# Altium project OBDII.PrjPCB
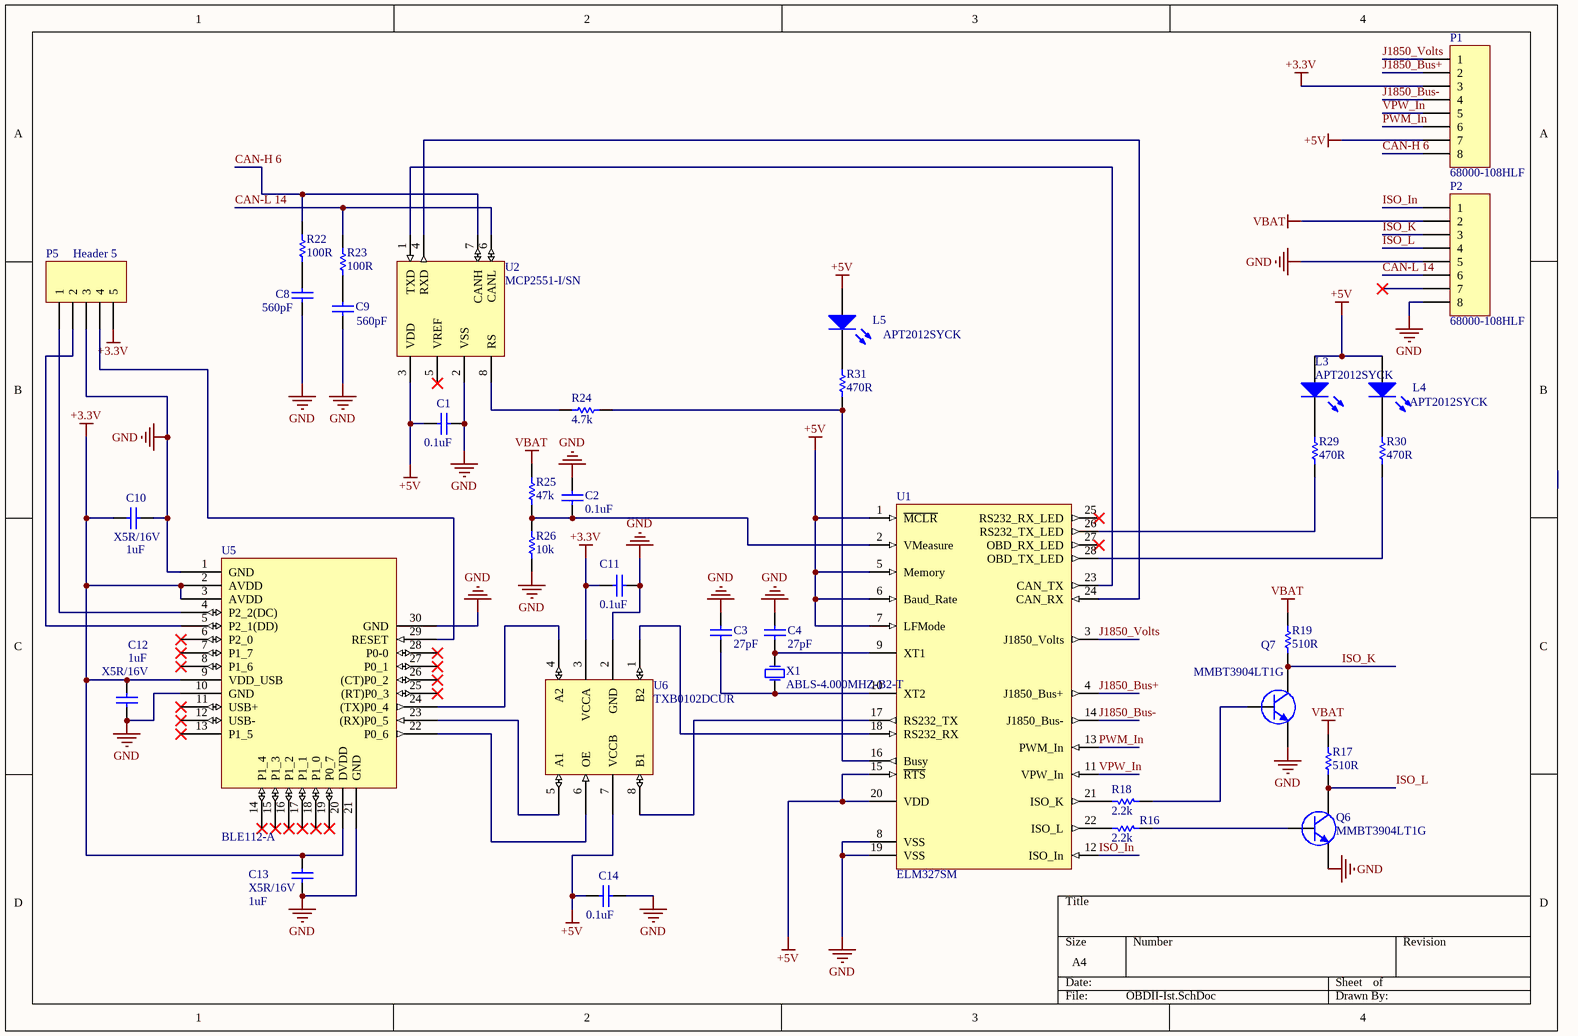
[diagram p0: OBDII-Ist.SchDoc]
2 sheets, 77 parts. Net scope: global (net labels, ports and power ports of the same name join across sheets).
Board file: OBDII-Ist.PcbDoc
Sheets:
  OBDII-Ist.SchDoc
  Power_.SchDoc

## Sheet OBDII-Ist.SchDoc
size A4

### Parts
C1  0.1uF  [1608[0603]]
C2  0.1uF  [1608[0603]]
C3  27pF  [1608[0603]]
C4  27pF  [1608[0603]]
C8  560pF  [0402]
C9  560pF  [0402]
C10  X5R/16V  value 1uF  [0402]
C11  0.1uF  [1608[0603]]
C12  X5R/16V  value 1uF  [0402]
C13  X5R/16V  value 1uF  [0402]
C14  0.1uF  [1608[0603]]
L3  APT2012SYCK  [LED-0805]
L4  APT2012SYCK  [LED-0805]
L5  APT2012SYCK  [LED-0805]
P1  68000-108HLF  [HDR1X8]
P2  68000-108HLF  [HDR1X8]
P5  Header 5  [HDR1X5]
Q6  MMBT3904LT1G  [SOT23]
Q7  MMBT3904LT1G  [SOT23]
R16  2.2k  [ERA-0805]
R17  510R  [ERJ-1210]
R18  2.2k  [ERA-0805]
R19  510R  [ERJ-1210]
R22  100R  [ERA-0805]
R23  100R  [ERA-0805]
R24  4.7k  [ERA-0805]
R25  47k  [ERA-0805]
R26  10k  [ERA-0805]
R29  470R  [ERA-0805]
R30  470R  [ERA-0805]
R31  470R  [ERA-0805]
U1  ELM327SM  [SOIC127P1030X264-28N]
U2  MCP2551-I/SN  [SOIC8N]
U5  BLE112-A  [BLE112-A - II]
U6  TXB0102DCUR  [TXB0102DCUR]
X1  ABLS-4.000MHZ-B2-T  [HC-49/US]

### Nets
+3.3V: C10.1 C11.1 C12.2 C13.2 P1.3 P5.5 U5.2(AVDD) U5.3(AVDD) U5.9(VDD_USB) U5.20(DVDD) U6.3(VCCA)
+5V: C1.1 C14.1 L3.1(A) L4.1(A) L5.1(A) P1.7 U1.1(~{MCLR}) U1.5(Memory) U1.6(Baud_Rate) U1.7(LFMode) U1.15(~{RTS}) U1.20(VDD) U2.3(VDD) U6.7(VCCB)
GND: C1.2 C2.2 C3.2 C4.2 C8.1 C9.1 C10.2 C11.2 C12.1 C13.1 C14.2 P2.5 P2.8 P5.3 Q6.2(E) Q7.2(E) R26.1 U1.8(VSS) U1.19(VSS) U2.2(VSS) U5.1(GND) U5.10(GND) U5.21(GND) U5.30(GND) U6.2(GND)
VBAT: P2.2 R17.2 R19.2 R25.2
CAN-H 6: P1.8 R22.2 U2.7(CANH)
CAN-L 14: P2.6 R23.2 U2.6(CANL)
ISO_In: P2.1 U1.12(ISO_In)
ISO_K: P2.3 Q7.3(C) R19.1
ISO_L: P2.4 Q6.3(C) R17.1
J1850_Bus+: P1.2 U1.4(J1850_Bus+)
J1850_Bus-: P1.4 U1.14(J1850_Bus-)
J1850_Volts: P1.1 U1.3(J1850_Volts)
PWM_In: P1.6 U1.13(PWM_In)
VPW_In: P1.5 U1.11(VPW_In)
NetC2_1: C2.1 R25.1 R26.2 U1.2(VMeasure)
NetC3_1: C3.1 U1.10(XT2) X1.1(OSC1)
NetC4_1: C4.1 U1.9(XT1) X1.2(OSC2)
NetC8_2: C8.2 R22.1
NetC9_2: C9.2 R23.1
NetL3_2: L3.2(K) R29.2
NetL4_2: L4.2(K) R30.2
NetL5_2: L5.2(K) R31.2
NetP5_1: P5.1 U5.4(P2_2(DC))
NetP5_2: P5.2 U5.5(P2_1(DD))
NetP5_4: P5.4 U5.29(RESET)
NetQ6_1: Q6.1(B) R16.1
NetQ7_1: Q7.1(B) R18.1
NetR16_2: R16.2 U1.22(ISO_L)
NetR18_2: R18.2 U1.21(ISO_K)
NetR24_1: R24.1 U2.8(RS)
NetR24_2: R24.2 R31.1 U1.16(Busy)
NetR29_1: R29.1 U1.26(RS232_TX_LED)
NetR30_1: R30.1 U1.28(OBD_TX_LED)
NetU1_17: U1.17(RS232_TX) U6.8(B1)
NetU1_18: U1.18(RS232_RX) U6.1(B2)
NetU1_23: U1.23(CAN_TX) U2.1(TXD)
NetU1_24: U1.24(CAN_RX) U2.4(RXD)
NetU5_22: U5.22(P0_6) U6.6(OE)
NetU5_23: U5.23((RX)P0_5) U6.5(A1)
NetU5_24: U5.24((TX)P0_4) U6.4(A2)

Not connected (* = marked no-connect by the designer): P2 7*; U1 25(RS232_RX_LED)* 27(OBD_RX_LED)*; U2 5(VREF)*; U5 6(P2_0)* 7(P1_7)* 8(P1_6)* 11(USB+)* 12(USB-)* 13(P1_5)* 14(P1_4)* 15(P1_3)* 16(P1_2)* 17(P1_1)* 18(P1_0)* 19(P0_7)* 25((RT)P0_3)* 26((CT)P0_2)* 27(P0_1)* 28(P0-0)*

### Library data of the parts
C1 C2 C11 C14 = CGA3E2X7R1E104K080AA: Surface-Mount Ceramic Multilayer Capacitor, 0.1uF, X7R, 10% Tolerance, 0603 Size, 25V; PackageReference: 0402; PackageDescription: Chip Capacitor; Site: http://product.tdk.com/capacitor/mlcc/en/documents/mlccspec_automotive_general_midvoltage_en.pdf; Value: 0.1uF; Publisher: Altium Limited
C3 C4 = CC0603JRNPO9BN270: Surface-Mount Ceramic Multilayer Capacitor, 27pF, 5% Tolerance, 0603 Size, 50V; PackageReference: 1608(0603); Publisher: Altium Limited; PackageDescription: Chip Capacitor; Site: http://www.mouser.com/ds/2/447/UPY-GP_NP0_16V-to-50V_%288%29-217813.pdf; Value: 27pF
C8 C9 = C0402C561J5GACTU: Surface-Mount Ceramic Multilayer Capacitor, 560pF, 5% Tolerance, 0402 Size, 50V; PackageReference: 0402; Publisher: Altium Limited; PackageDescription: Chip Capacitor; Site: http://www.kemet.com/kemet/web/homepage/kechome.nsf/vapubfiles/KEM_C1003_C0G_SMD.pdf/$file/KEM_C1003_C0G_SMD.pdf; Value: 560pF
C10 C12 C13 = Cap Semi: Capacitor (Semiconductor SIM Model); Published: 8-Jun-2000; LatestRevisionDate: 29-May-2009; LatestRevisionNote: IPC-7351 Footprint Added.; PackageReference: C1206; Publisher: Altium Limited; PackageDescription: Chip Capacitor
L3-L5 = APT2012SYCK: Typical BLUE SiC LED; LatestRevisionNote: PCB Footprint replaced.; PackageReference: 0805; PackageDescription: SM LED; Body 2.0x 1.25 x 0.75mm, inc leads (LxWxH typ)
P1 P2 = 68000-108HLF: Header, 8-Pin, 2.54 pitch, 1 row; LatestRevisionDate: 17-Jul-2002; LatestRevisionNote: Re-released for DXP Platform.; Publisher: Altium Limited
P5 = Header 5: Header, 5-Pin; LatestRevisionDate: 17-Jul-2002; LatestRevisionNote: Re-released for DXP Platform.; Publisher: Altium Limited
Q6 Q7 = MMBT3904L: NPN 3904 General Purpose Amplifier; Manufacturer: ON Semiconductor; Value: 0.2A, 40V; Approved: Yes by Implemenation; TargetLibrary: Transistors; Published: 8/13/2009; Publisher: Vanteon; LeadFree: Yes; RoHS: Yes; PartNumber: MMBT3904LT1G; ComponentLink1Description: Datasheet; ComponentLink1URL: http://www.onsemi.com/pub_link/Collateral/MMBT3904LT1-D.PDF; Status: Active; Supplier 1: Digi-Key; Supplier Part Number 1: MMBT3904LT1GOSCT-ND
R16 R18 = ERA6AEB222V: Rectangular Thick Film Chip Resistor, 2.2 kOhm, 0.1% Tolerance, 0805 Size, 0.125 W; Note: If flow soldering, adjust pad width of PCB Footprint to 0.7 - 0.8 times the width of the resistor.; LatestRevisionNote: Silkscreen size reduced.; PackageReference: ERA-0805; Code_IPC: 2012 [0805]; ComponentLink1Description: Manufacturer Link; ComponentLink1URL: http://industrial.panasonic.com/www-data/pdf/AOA0000/AOA0000CE26.pdf; Value: 2.2k
R17 R19 = ERJ14NF5100U: Rectangular Thick Film Chip Resistor, 510 Ohm, 1% Tolerance, 1210 Size, 0.5 W; Note: If flow soldering, adjust pad width of PCB Footprint to 0.7 - 0.8 times the width of the resistor.; LatestRevisionNote: Silkscreen size reduced.; PackageReference: ERA-1210; Code_IPC: 2012 [1210]; ComponentLink1Description: Manufacturer Link; ComponentLink1URL: http://industrial.panasonic.com/www-data/pdf/AOA0000/AOA0000CE26.pdf; Value: 510R
R22 R23 = ERA6AEB101V: Rectangular Thick Film Chip Resistor, 100 Ohm, 0.1% Tolerance, 0805 Size, 0.125 W; Note: If flow soldering, adjust pad width of PCB Footprint to 0.7 - 0.8 times the width of the resistor.; LatestRevisionNote: Silkscreen size reduced.; PackageReference: ERA-0805; Code_IPC: 2012 [0805]; ComponentLink1Description: Manufacturer Link; ComponentLink1URL: http://industrial.panasonic.com/www-data/pdf/AOA0000/AOA0000CE26.pdf; Value: 100R
R24 = ERA6AEB472V: Rectangular Thick Film Chip Resistor, 4.7 kOhm, 0.1% Tolerance, 0805 Size, 0.125 W; Note: If flow soldering, adjust pad width of PCB Footprint to 0.7 - 0.8 times the width of the resistor.; LatestRevisionNote: Silkscreen size reduced.; PackageReference: ERA-0805; Code_IPC: 2012 [0805]; ComponentLink1Description: Manufacturer Link; ComponentLink1URL: http://industrial.panasonic.com/www-data/pdf/AOA0000/AOA0000CE26.pdf; Value: 4.7k
R25 = ERA6AEB473V: Rectangular Thick Film Chip Resistor, 47 kOhm, 0.1% Tolerance, 0805 Size, 0.125 W; Note: If flow soldering, adjust pad width of PCB Footprint to 0.7 - 0.8 times the width of the resistor.; LatestRevisionNote: Silkscreen size reduced.; PackageReference: ERA-0805; Code_IPC: 2012 [0805]; ComponentLink1Description: Manufacturer Link; ComponentLink1URL: http://industrial.panasonic.com/www-data/pdf/AOA0000/AOA0000CE26.pdf; Value: 47k
R26 = ERA6AEB103V: Rectangular Thick Film Chip Resistor, 10 kOhm, 0.1% Tolerance, 0805 Size, 0.125 W; Note: If flow soldering, adjust pad width of PCB Footprint to 0.7 - 0.8 times the width of the resistor.; LatestRevisionNote: Silkscreen size reduced.; PackageReference: ERA-0805; Code_IPC: 2012 [0805]; ComponentLink1Description: Manufacturer Link; ComponentLink1URL: http://industrial.panasonic.com/www-data/pdf/AOA0000/AOA0000CE26.pdf; Value: 10k
R29-R31 = ERA6AEB471V: Rectangular Thick Film Chip Resistor, 470 Ohm, 0.1% Tolerance, 0805 Size, 0.125 W; Note: If flow soldering, adjust pad width of PCB Footprint to 0.7 - 0.8 times the width of the resistor.; LatestRevisionNote: Silkscreen size reduced.; PackageReference: ERA-0805; Code_IPC: 2012 [0805]; ComponentLink1Description: Manufacturer Link; ComponentLink1URL: http://industrial.panasonic.com/www-data/pdf/AOA0000/AOA0000CE26.pdf; Value: 470R
U1 = ELM327_SOIC: OBDII Interpreter IC; Manufacturer: Elm Electronics; PartNumber: ELM327SM
U2 = MCP2551-I/SN: IC TRANSCEIVER CAN HI-SPD 8-SOIC; Manufacturer: Microchip Technology; PartNumber: MCP2551-I/SN
U5 = BLE112-A: BLE112 Bluetooth Smart Module; Site: http://www.bluegiga.com/en-US/products/bluetooth-4.0-modules/ble112-bluetooth--smart-module/
U6 = TXB0102DCUR: 2-Bit Bidirectional Voltage-Level Translator with Auto Direction Sensing and +/-15-kV ESD Protect; Site: http://www.ti.com/lit/gpn/txb0102
X1 = ABLS-4.000MHZ-B2-T: CRYSTAL 4.000 MHZ 18PF SMD; Manufacturer: Abracon; Value: 4MHz; PartNumber: ABLS-4.000MHZ-B2-T; Site: http://www.abracon.com/Resonators/abls.pdf

## Sheet Power_.SchDoc
size A4
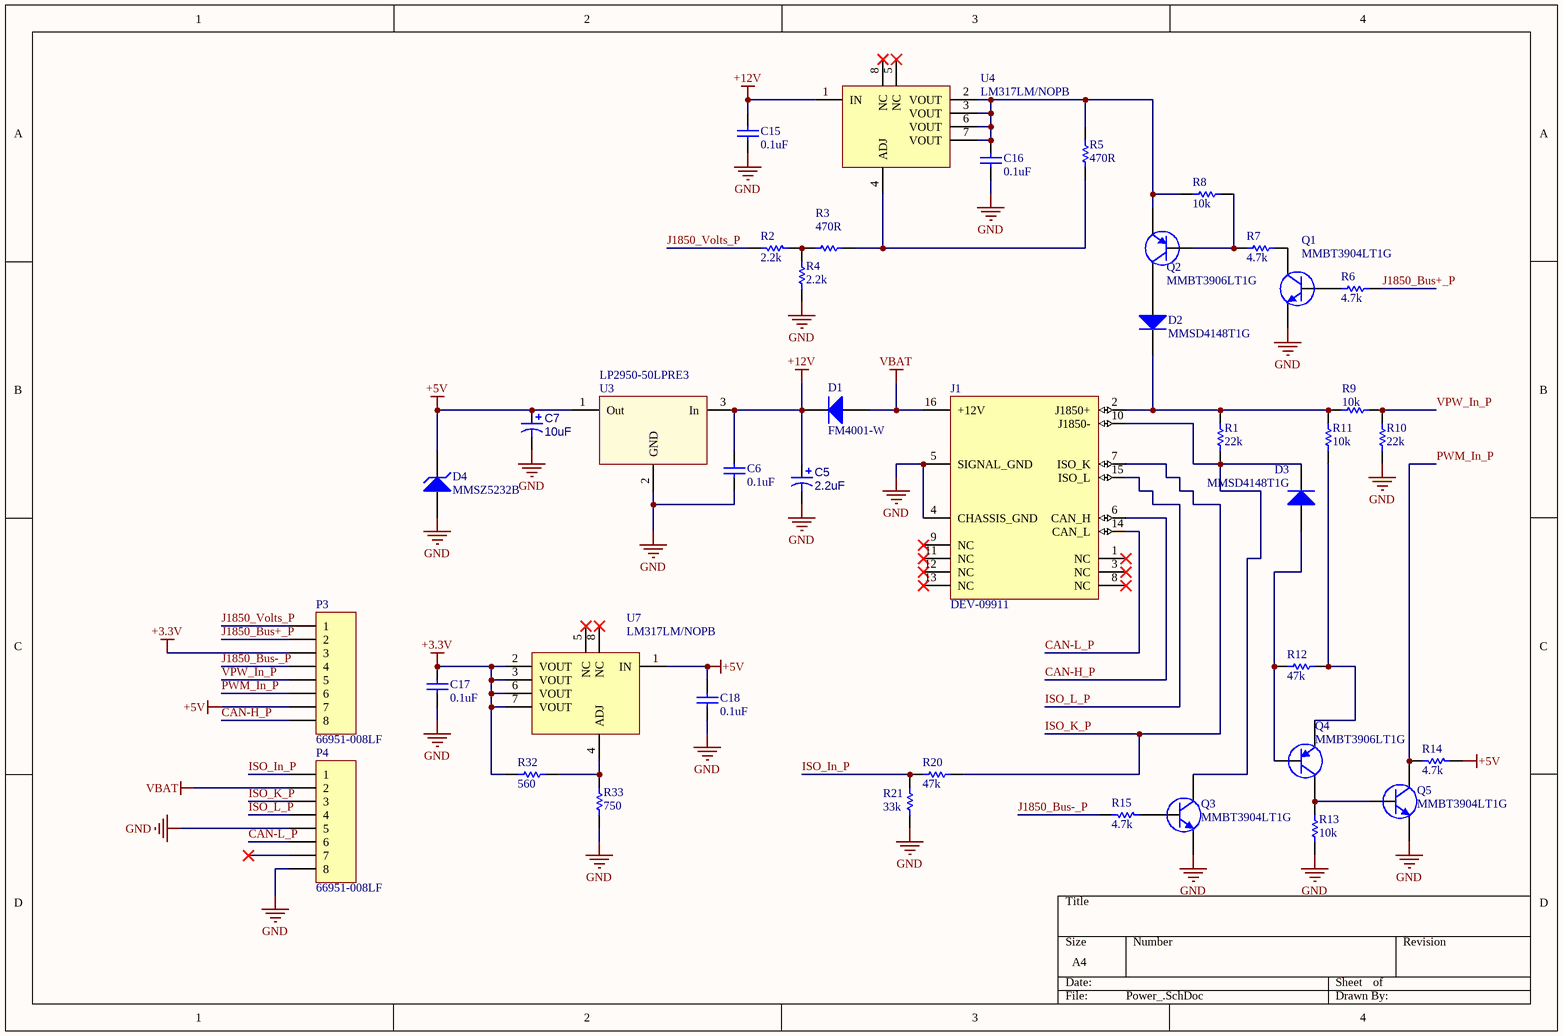
[diagram p1: Power_.SchDoc]

### Parts
C5  2.2uF  [Panasonic_Ñ]
C6  0.1uF  [1608[0603]]
C7  10uF  [Panasonic_B]
C15  0.1uF  [1608[0603]]
C16  0.1uF  [1608[0603]]
C17  0.1uF  [1608[0603]]
C18  0.1uF  [1608[0603]]
D1  FM4001-W  [SMA,2.8mm]
D2  MMSD4148T1G  [SOD123]
D3  MMSD4148T1G  [SOD123]
D4  MMSZ5232B  [SOD123]
J1  DEV-09911  [DEV-09911 - II]
P3  66951-008LF  [HDR1X8]
P4  66951-008LF  [HDR1X8]
Q1  MMBT3904LT1G  [SOT23]
Q2  MMBT3906LT1G  [SOT23]
Q3  MMBT3904LT1G  [SOT23]
Q4  MMBT3906LT1G  [SOT23]
Q5  MMBT3904LT1G  [SOT23]
R1  22k  [ERA-0805]
R2  2.2k  [ERA-0805]
R3  470R  [ERA-0805]
R4  2.2k  [ERA-0805]
R5  470R  [ERA-0805]
R6  4.7k  [ERA-0805]
R7  4.7k  [ERA-0805]
R8  10k  [ERA-0805]
R9  10k  [ERA-0805]
R10  22k  [ERA-0805]
R11  10k  [ERA-0805]
R12  47k  [ERA-0805]
R13  10k  [ERA-0805]
R14  4.7k  [ERA-0805]
R15  4.7k  [ERA-0805]
R20  47k  [ERA-0805]
R21  33k  [ERA-0805]
R32  560  [ERA-0805]
R33  750  [ERA-0805]
U3  LP2950-50LPRE3  [TO-92]
U4  LM317LM/NOPB  [SOIC8N]
U7  LM317LM/NOPB  [SOIC8N]

### Nets
+3.3V: C17.2 P3.3 R32.1 U7.2(VOUT) U7.3(VOUT) U7.6(VOUT) U7.7(VOUT)
+5V: C7.1 C18.2 D4.1(K) P3.7 R14.1 U3.1(Out) U7.1(IN)
+12V: C5.1 C6.2 C15.2 D1.2(K) U3.3(In) U4.1(IN)
GND: C5.2 C6.1 C7.2 C15.1 C16.1 C17.1 C18.1 D4.2(A) J1.4(CHASSIS_GND) J1.5(SIGNAL_GND) P4.5 P4.8 Q1.2(E) Q3.2(E) Q5.2(E) R4.1 R10.1 R13.2 R21.1 R33.1 U3.2(GND)
VBAT: D1.1(A) J1.16(+12V) P4.2
CAN-H_P: J1.6(CAN_H) P3.8
CAN-L_P: J1.14(CAN_L) P4.6
ISO_In_P: P4.1 R20.1 R21.2
ISO_K_P: J1.7(ISO_K) P4.3 R20.2
ISO_L_P: J1.15(ISO_L) P4.4
J1850_Bus+_P: P3.2 R6.2
J1850_Bus-_P: P3.4 R15.2
J1850_Volts_P: P3.1 R2.2
PWM_In_P: P3.6 Q5.3(C) R14.2
VPW_In_P: P3.5 R9.1 R10.2
NetC16_2: C16.2 Q2.2(E) R5.2 R8.2 U4.2(VOUT) U4.3(VOUT) U4.6(VOUT) U4.7(VOUT)
NetD2_1: D2.1(A) Q2.3(C)
NetD2_2: D2.2(C) J1.2(J1850+) R1.2 R9.2 R11.1
NetD3_1: D3.1(A) Q4.1(B) R12.1
NetD3_2: D3.2(C) J1.10(J1850-) Q3.3(C) R1.1
NetQ1_1: Q1.1(B) R6.1
NetQ1_3: Q1.3(C) R7.2
NetQ2_1: Q2.1(B) R7.1 R8.1
NetQ3_1: Q3.1(B) R15.1
NetQ4_2: Q4.2(E) R11.2 R12.2
NetQ4_3: Q4.3(C) Q5.1(B) R13.1
NetR2_1: R2.1 R3.2 R4.2
NetR3_1: R3.1 R5.1 U4.4(ADJ)
NetR32_2: R32.2 R33.2 U7.4(ADJ)

Not connected (* = marked no-connect by the designer): J1 1(NC)* 3(NC)* 8(NC)* 9(NC)* 11(NC)* 12(NC)* 13(NC)*; P4 7*; U4 5(NC)* 8(NC)*; U7 5(NC)* 8(NC)*

### Library data of the parts
C5 = EEE-1HA2R2NR: CAP ELECT 2.2UF SV 50V SMD; Manufacturer: Panasonic; Tolerance: +/-20%; Value: 2.2uF; PartNumber: EEE-1HA2R2NR; Voltage: 50V
C6 C17 C18 = C0603C104K5RACTU: Surface-Mount Ceramic Multilayer Capacitor, 0.1uF, 10% Tolerance, 0603 Size, 50V; PackageReference: 1608(0603); PackageDescription: Chip Capacitor; Site: http://www.kemet.com/kemet/web/homepage/kechome.nsf/vapubfiles/KEM_C1002_X7R_SMD.pdf/$file/KEM_C1002_X7R_SMD.pdf; Value: 0.1uF
C7 = EEE-1AA100NR: CAP ELECT 10UF SV 10V SMD; Manufacturer: Panasonic; Tolerance: +/-20%; Value: 10uF; PartNumber: EEE-1AA100NR; Voltage: 10V
C15 C16 = CGA3E2X7R1E104K080AA: as C1 on sheet OBDII-Ist; PackageReference: 0402; PackageDescription: Chip Capacitor; Site: http://product.tdk.com/capacitor/mlcc/en/documents/mlccspec_automotive_general_midvoltage_en.pdf; Value: 0.1uF; Publisher: Altium Limited
D1 = FM4001-W: 1 Amp 50V  Rectifier; PackageReference: DO214AC(SMA); ComponentLink1Description: Datasheet; ComponentLink1URL: http://lib.chipdip.ru/758/DOC000758182.pdf
D2 D3 = MMSD4148T1G: High Conductance Fast Diode; Manufacturer: OnSemi; Approved: M. Jablonski; TargetLibrary: Diodes; Current: 200 mA; Published: 6/4/2009; Publisher: Vanteon; LeadFree: Yes; RoHS: Yes; PartNumber: MMSD4148T1G; ComponentLink1Description: Datasheet; ComponentLink1URL: http://www.onsemi.com/pub_link/Collateral/MMSD4148T1-D.PDF; Status: Active; Supplier 1: Digi-Key; Supplier Part Number 1: MMSD4148T1GOSCT-ND
D4 = MMSZ5232B: Zener Diodes 5.6 Volt 0.5W 5%; PackageReference: SOD-123; PackageDescription: Diode, Thru-Hole; 2 Leads; 0.7 in Pin Spacing
J1 = OBDII_DEV-09911: OBD-II Connector; Manufacturer: SparkFun Electronics; PartNumber: DEV-09911
P3 P4 = 66951-008LF: Connector, 8-Pin, 2.54 pitch, 1 row; LatestRevisionDate: 17-Jul-2002; LatestRevisionNote: Re-released for DXP Platform.; Publisher: Altium Limited
Q1 Q3 Q5 = MMBT3904L: as Q6 on sheet OBDII-Ist; Published: 8/13/2009; Publisher: Vanteon; LeadFree: Yes; RoHS: Yes; PartNumber: MMBT3904LT1G; ComponentLink1Description: Datasheet; ComponentLink1URL: http://www.onsemi.com/pub_link/Collateral/MMBT3904LT1-D.PDF; Status: Active; Supplier 1: Digi-Key; Supplier Part Number 1: MMBT3904LT1GOSCT-ND
Q2 Q4 = MMBT3906L: PNP 3906 General Purpose Amplifier; Manufacturer: ON Semiconductor; Value: 0.2A, -40V; Approved: Yes by Implemenation; TargetLibrary: Transistors; Published: 8/13/2009; Publisher: Vanteon; LeadFree: Yes; RoHS: Yes; PartNumber: MMBT3906LT1G; ComponentLink1Description: Datasheet; ComponentLink1URL: http://www.onsemi.com/pub_link/Collateral/MMBT3906LT1-D.PDF; Status: Active; Supplier 1: Digi-Key; Supplier Part Number 1: MMBT3906LT1GOSCT-ND
R1 R10 = ERA6AEB223V: Rectangular Thick Film Chip Resistor, 22 kOhm, 0.1% Tolerance, 0805 Size, 0.125 W; Note: If flow soldering, adjust pad width of PCB Footprint to 0.7 - 0.8 times the width of the resistor.; LatestRevisionNote: Silkscreen size reduced.; PackageReference: ERA-0805; Code_IPC: 2012 [0805]; ComponentLink1Description: Manufacturer Link; ComponentLink1URL: http://industrial.panasonic.com/www-data/pdf/AOA0000/AOA0000CE26.pdf; Value: 22k
R2 R4 = ERA6AEB222V: as R16 on sheet OBDII-Ist; LatestRevisionNote: Silkscreen size reduced.; PackageReference: ERA-0805; Code_IPC: 2012 [0805]; ComponentLink1Description: Manufacturer Link; ComponentLink1URL: http://industrial.panasonic.com/www-data/pdf/AOA0000/AOA0000CE26.pdf; Value: 2.2k
R3 R5 = ERA6AEB471V: as R29 on sheet OBDII-Ist; LatestRevisionNote: Silkscreen size reduced.; PackageReference: ERA-0805; Code_IPC: 2012 [0805]; ComponentLink1Description: Manufacturer Link; ComponentLink1URL: http://industrial.panasonic.com/www-data/pdf/AOA0000/AOA0000CE26.pdf; Value: 470R
R6 R7 R14 R15 = ERA6AEB472V: as R24 on sheet OBDII-Ist; LatestRevisionNote: Silkscreen size reduced.; PackageReference: ERA-0805; Code_IPC: 2012 [0805]; ComponentLink1Description: Manufacturer Link; ComponentLink1URL: http://industrial.panasonic.com/www-data/pdf/AOA0000/AOA0000CE26.pdf; Value: 4.7k
R8 R9 R11 R13 = ERA6AEB103V: as R26 on sheet OBDII-Ist; LatestRevisionNote: Silkscreen size reduced.; PackageReference: ERA-0805; Code_IPC: 2012 [0805]; ComponentLink1Description: Manufacturer Link; ComponentLink1URL: http://industrial.panasonic.com/www-data/pdf/AOA0000/AOA0000CE26.pdf; Value: 10k
R12 R20 = ERA6AEB473V: as R25 on sheet OBDII-Ist; LatestRevisionNote: Silkscreen size reduced.; PackageReference: ERA-0805; Code_IPC: 2012 [0805]; ComponentLink1Description: Manufacturer Link; ComponentLink1URL: http://industrial.panasonic.com/www-data/pdf/AOA0000/AOA0000CE26.pdf; Value: 47k
R21 = ERA6AEB333V: Rectangular Thick Film Chip Resistor, 33 kOhm, 0.1% Tolerance, 0805 Size, 0.125 W; Note: If flow soldering, adjust pad width of PCB Footprint to 0.7 - 0.8 times the width of the resistor.; LatestRevisionNote: Silkscreen size reduced.; PackageReference: ERA-0805; Code_IPC: 2012 [0805]; ComponentLink1Description: Manufacturer Link; ComponentLink1URL: http://industrial.panasonic.com/www-data/pdf/AOA0000/AOA0000CE26.pdf; Value: 33k
R32 = ERJ6ENF5600V: Rectangular Thick Film Chip Resistor, 560 Ohm, 1% Tolerance, 0805 Size, 0.125 W; Note: If flow soldering, adjust pad width of PCB Footprint to 0.7 - 0.8 times the width of the resistor.; LatestRevisionNote: Silkscreen size reduced.; PackageReference: ERA-0805; Code_IPC: 2012 [0805]; ComponentLink1Description: Manufacturer Link; ComponentLink1URL: http://industrial.panasonic.com/www-data/pdf/AOA0000/AOA0000CE26.pdf; Value: 560
R33 = ERJ6ENF7500V: Rectangular Thick Film Chip Resistor, 750 Ohm, 1% Tolerance, 0805 Size, 0.125 W; Note: If flow soldering, adjust pad width of PCB Footprint to 0.7 - 0.8 times the width of the resistor.; LatestRevisionNote: Silkscreen size reduced.; PackageReference: ERA-0805; Code_IPC: 2012 [0805]; ComponentLink1Description: Manufacturer Link; ComponentLink1URL: http://industrial.panasonic.com/www-data/pdf/AOA0000/AOA0000CE26.pdf; Value: 750
U3 = LP2950-50LPRE3: Adjustable Micropower Voltage Regulator With Shutdown; 5V; 100 mA; PackageReference: TO-92; ComponentLink1Description: Datasheet; ComponentLink1URL: http://www.ti.com/lit/ds/slvs582h/slvs582h.pdf
U4 U7 = LM317LM: 3-terminal adjustable regulator in SO8; Manufacturer: National Semiconductor; Approved: Yes by Implementation; TargetLibrary: Power IC; PartNumber: LM317LM/NOPB; Publisher: Vanteon; Published: 8/3/2009; ComponentLink1Description: Datasheet; ComponentLink1URL: http://www.national.com/ds/LM/LM317L.pdf; LeadFree: Yes; RoHS: Yes; Status: Active; Supplier 1: Digi-Key; Supplier Part Number 1: LM317LM-ND

## Nets that join several sheets
+3.3V: OBDII-Ist (11 pins), Power_ (7 pins)
+5V: OBDII-Ist (14 pins), Power_ (7 pins)
GND: OBDII-Ist (25 pins), Power_ (21 pins)
VBAT: OBDII-Ist (P2.2 R17.2 R19.2 R25.2), Power_ (D1.1 J1.16 P4.2)